# Altium schematic sheet MicrocontrollerTwo.SchDoc: Microcontroller 2
size Letter; Date: Jul 31/2018; Revision: 1; SheetNumber: 7; SheetTotal: 9
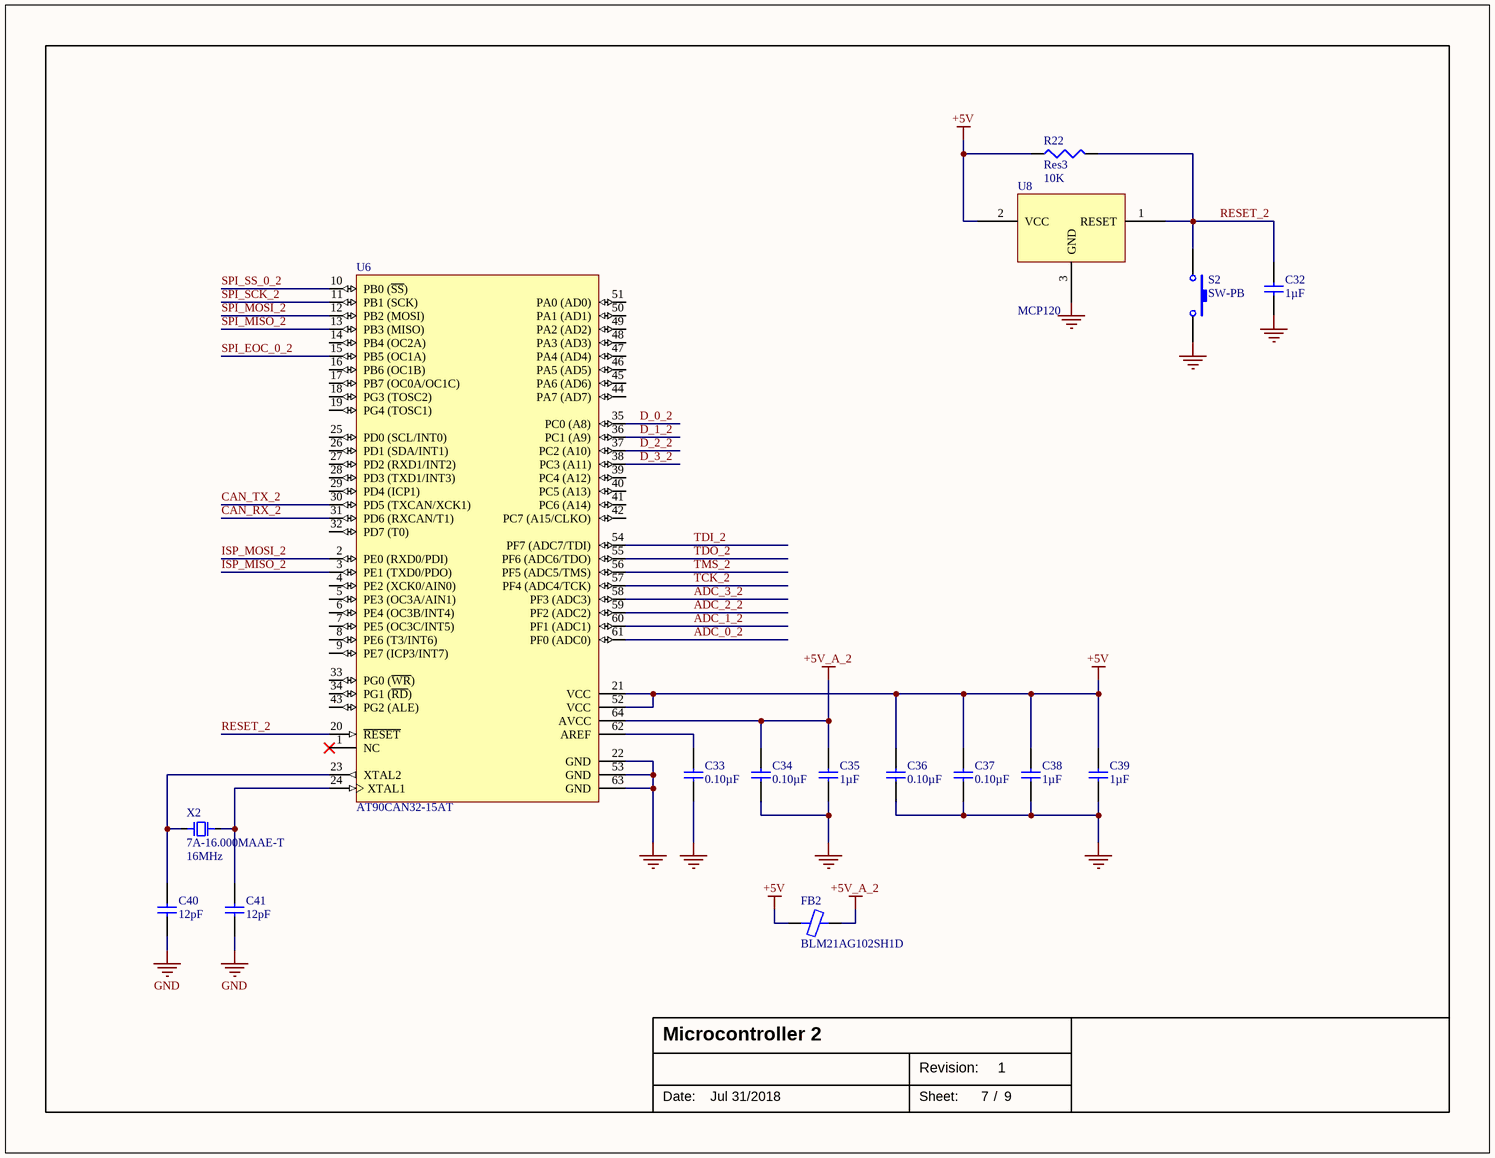
[diagram p0: MicrocontrollerTwo.SchDoc]

## Parts
C32  value 1µF  [1206]  (hidden comment: CAP 1µF ±10% 16V 0805 X7R)
C33  value 0.10µF  [1206]  (hidden comment: CAP 0.10µF ±10% 16V 0402 X7R)
C34  value 0.10µF  [1206]  (hidden comment: CAP 0.10µF ±10% 16V 0402 X7R)
C35  value 1µF  [1206]  (hidden comment: CAP 1µF ±10% 16V 0805 X7R)
C36  value 0.10µF  [1206]  (hidden comment: CAP 0.10µF ±10% 16V 0402 X7R)
C37  value 0.10µF  [1206]  (hidden comment: CAP 0.10µF ±10% 16V 0402 X7R)
C38  value 1µF  [1206]  (hidden comment: CAP 1µF ±10% 16V 0805 X7R)
C39  value 1µF  [1206]  (hidden comment: CAP 1µF ±10% 16V 0805 X7R)
C40  value 12pF  [1206]  (hidden comment: CAP 12pF ±5% 50V 0402 C0G, NP0)
C41  value 12pF  [1206]  (hidden comment: CAP 12pF ±5% 50V 0402 C0G, NP0)
FB2  BLM21AG102SH1D  [INDC2012X11N]
R22  Res3  value 10K  [1206]
S2  SW-PB  [Switch]
U6  AT90CAN32-15AT  [TQFP80P1600X1600X120-64N]
U8  MCP120  [MCP120]
X2  7A-16.000MAAE-T  value 16MHz  [QFN200P500X320X135-2N]

## Nets
+5V: C36.2 C37.2 C38.1 C39.1 FB2.1 R22.1 U6.21(VCC) U6.52(VCC) U8.2(VCC)
+5V_A_2: C34.2 C35.1 FB2.2 U6.64(AVCC)
GND: C32.2 C33.1 C34.1 C35.2 C36.1 C37.1 C38.2 C39.2 C40.1 C41.1 S2.2 U6.22(GND) U6.53(GND) U6.63(GND) U8.3(GND)
ADC_0_2: U6.61(PF0_(ADC0))
ADC_1_2: U6.60(PF1_(ADC1))
ADC_2_2: U6.59(PF2_(ADC2))
ADC_3_2: U6.58(PF3_(ADC3))
CAN_RX_2: U6.31(PD6_(RXCAN/T1))
CAN_TX_2: U6.30(PD5_(TXCAN/XCK1))
D_0_2: U6.35(PC0_(A8))
D_1_2: U6.36(PC1_(A9))
D_2_2: U6.37(PC2_(A10))
D_3_2: U6.38(PC3_(A11))
ISP_MISO_2: U6.3(PE1_(TXD0/PDO))
ISP_MOSI_2: U6.2(PE0_(RXD0/PDI))
RESET_2: C32.1 R22.2 S2.1 U6.20(~{RESET}) U8.1(RESET)
SPI_EOC_0_2: U6.15(PB5_(OC1A))
SPI_MISO_2: U6.13(PB3_(MISO))
SPI_MOSI_2: U6.12(PB2_(MOSI))
SPI_SCK_2: U6.11(PB1_(SCK))
SPI_SS_0_2: U6.10(PB0_(~{SS}))
TCK_2: U6.57(PF4_(ADC4/TCK))
TDI_2: U6.54(PF7_(ADC7/TDI))
TDO_2: U6.55(PF6_(ADC6/TDO))
TMS_2: U6.56(PF5_(ADC5/TMS))
NetC33_2: C33.2 U6.62(AREF)
NetC40_2: C40.2 U6.23(XTAL2) X2.1
NetC41_2: C41.2 U6.24(XTAL1) X2.2

Not connected (* = marked no-connect by the designer): U6 1(NC)* 4(PE2_(XCK0/AIN0)) 5(PE3_(OC3A/AIN1)) 6(PE4_(OC3B/INT4)) 7(PE5_(OC3C/INT5)) 8(PE6_(T3/INT6)) 9(PE7_(ICP3/INT7)) 14(PB4_(OC2A)) 16(PB6_(OC1B)) 17(PB7_(OC0A/OC1C)) 18(PG3_(TOSC2)) 19(PG4_(TOSC1)) 25(PD0_(SCL/INT0)) 26(PD1_(SDA/INT1)) 27(PD2_(RXD1/INT2)) 28(PD3_(TXD1/INT3)) 29(PD4_(ICP1)) 32(PD7_(T0)) 33(PG0_(~{WR})) 34(PG1_(~{RD})) 39(PC4_(A12)) 40(PC5_(A13)) 41(PC6_(A14)) 42(PC7_(A15/CLKO)) 43(PG2_(ALE)) 44(PA7_(AD7)) 45(PA6_(AD6)) 46(PA5_(AD5)) 47(PA4_(AD4)) 48(PA3_(AD3)) 49(PA2_(AD2)) 50(PA1_(AD1)) 51(PA0_(AD0))

## Notes on the sheet
- Date:
- Revision:
- Sheet:
- /

## Library data of the parts
C32 C35 C38 C39 = CC0805KKX7R7BB105: Manufacturer: Yageo; Manufacturer Series: CC; Part Number: CC0805KKX7R7BB105; Component Type: Standard; Tolerance: ±10%; Voltage: 16V; Package: 0805; Temperature Coefficient: X7R; Temperature Range: -55°C ~ 125°C; Supplier 1: Digi-Key; Supplier Part Number 1: 311-1365-1-ND
C33 C34 C36 C37 = CC0402KRX7R7BB104: Manufacturer: Yageo; Manufacturer Series: CC; Part Number: CC0402KRX7R7BB104; Component Type: Standard; Tolerance: ±10%; Voltage: 16V; Package: 0402; Temperature Coefficient: X7R; Temperature Range: -55°C ~ 125°C; Supplier 1: Digi-Key; Supplier Part Number 1: 311-1338-1-ND
C40 C41 = CC0402JRNPO9BN120: Manufacturer: Yageo; Manufacturer Series: CC; Part Number: CC0402JRNPO9BN120; Component Type: Standard; Tolerance: ±5%; Voltage: 50V; Package: 0402; Temperature Coefficient: C0G, NP0; Temperature Range: -55°C ~ 125°C; Supplier 1: Digi-Key; Supplier Part Number 1: 311-1016-1-ND
R22 = Res3: Resistor; Published: 8-Jun-2000; LatestRevisionDate: 29-May-2009; LatestRevisionNote: IPC-7351 Footprint Added.; PackageReference: J1-0603; Publisher: Altium Limited; PackageDescription: Chip Resistor
S2 = SW-PB: Switch; Published: 24-Mar-1999; LatestRevisionDate: 17-Jul-2002; LatestRevisionNote: Re-released for DXP Platform.; PackageReference: SPST-2; Publisher: Altium Limited; PackageDescription: Switch; 2 Leads
X2 = 7A-16.000MAAE-T: SMD Crystal Oscillator 12 pF; Load Capacitance: 12pF; Supplier 1: Digi-Key; Supplier Part Number 1: 887-1747-1-ND
FB2 = BLM21AG102SH1D: Supplier 1: Digi-Key; Supplier Part Number 1: 490-10664-1-ND
U6 = AT90CAN32-15AT: Supplier 1: Digi-Key; Supplier Part Number 1: AT90CAN32-15ATCT-ND